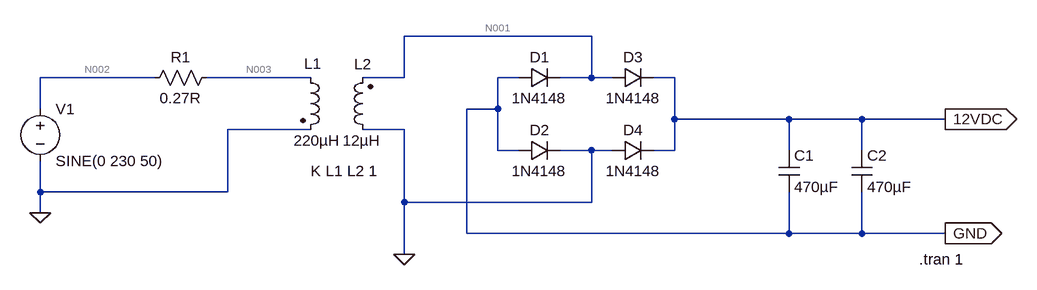
[diagram p0: schematic AC-DC CONVERTER.asc]
AC-DC CONVERTER.asc, the LTspice schematic file:
Version 4
SHEET 1 1160 680
WIRE 480 -16 192 -16
WIRE -192 48 -368 48
WIRE 48 48 -112 48
WIRE 192 48 192 -16
WIRE 192 48 128 48
WIRE 368 48 336 48
WIRE 480 48 480 -16
WIRE 480 48 432 48
WIRE 512 48 480 48
WIRE 608 48 576 48
WIRE -368 96 -368 48
WIRE 336 96 336 48
WIRE 336 96 288 96
WIRE 608 112 608 48
WIRE 784 112 608 112
WIRE 896 112 784 112
WIRE 1024 112 896 112
WIRE 48 128 -80 128
WIRE 192 128 128 128
WIRE 336 160 336 96
WIRE 368 160 336 160
WIRE 480 160 432 160
WIRE 512 160 480 160
WIRE 608 160 608 112
WIRE 608 160 576 160
WIRE 784 160 784 112
WIRE 896 160 896 112
WIRE -368 224 -368 176
WIRE -80 224 -80 128
WIRE -80 224 -368 224
WIRE 192 240 192 128
WIRE 480 240 480 160
WIRE 480 240 192 240
WIRE -368 256 -368 224
WIRE 288 288 288 96
WIRE 784 288 784 224
WIRE 784 288 288 288
WIRE 896 288 896 224
WIRE 896 288 784 288
WIRE 1024 288 896 288
WIRE 192 320 192 240
FLAG -368 256 0
FLAG 192 320 0
FLAG 1024 112 12VDC
IOPIN 1024 112 Out
FLAG 1024 288 GND
IOPIN 1024 288 Out
SYMBOL voltage -368 80 R0
WINDOW 123 0 0 Left 0
WINDOW 39 0 0 Left 0
SYMATTR InstName V1
SYMATTR Value SINE(0 230 50)
SYMBOL res -96 32 R90
WINDOW 0 0 56 VBottom 2
WINDOW 3 32 56 VTop 2
SYMATTR InstName R1
SYMATTR Value 0.27R
SYMBOL ind2 32 32 R0
WINDOW 0 6 -6 Left 2
WINDOW 3 -10 113 Left 2
SYMATTR InstName L1
SYMATTR Value 220µH
SYMATTR Type ind
SYMBOL ind2 144 144 R180
WINDOW 0 2 117 Left 2
WINDOW 3 -11 -1 Left 2
SYMATTR InstName L2
SYMATTR Value 12µH
SYMATTR Type ind
SYMBOL diode 368 64 R270
WINDOW 0 32 32 VTop 2
WINDOW 3 0 32 VBottom 2
SYMATTR InstName D1
SYMATTR Value 1N4148
SYMBOL diode 368 176 R270
WINDOW 0 32 32 VTop 2
WINDOW 3 0 32 VBottom 2
SYMATTR InstName D2
SYMATTR Value 1N4148
SYMBOL diode 512 64 R270
WINDOW 0 32 32 VTop 2
WINDOW 3 0 32 VBottom 2
SYMATTR InstName D3
SYMATTR Value 1N4148
SYMBOL diode 512 176 R270
WINDOW 0 32 32 VTop 2
WINDOW 3 0 32 VBottom 2
SYMATTR InstName D4
SYMATTR Value 1N4148
SYMBOL cap 768 160 R0
SYMATTR InstName C1
SYMATTR Value 470µF
SYMBOL cap 880 160 R0
SYMATTR InstName C2
SYMATTR Value 470µF
TEXT 48 192 Left 2 !K L1 L2 1
TEXT 984 328 Left 2 !.tran 1

The netlist it stands for:
* AC-DC CONVERTER.asc
V1 N002 0 SINE(0 230 50)
R1 N003 N002 0.27R
L1 N003 0 220µH
L2 0 N001 12µH
D1 GND N001 1N4148
D2 GND 0 1N4148
D3 N001 12VDC 1N4148
D4 0 12VDC 1N4148
C1 12VDC GND 470µF
C2 12VDC GND 470µF
.model D D
.lib standard.dio
K L1 L2 1
.tran 1
.backanno
.end

* Results of the author's LTspice run, read from the files saved beside the schematic
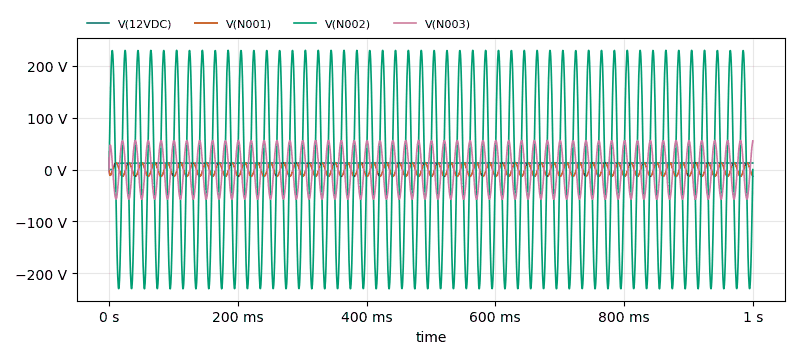
[diagram p1: Transient Analysis of AC-DC CONVERTER.asc, plotted from the saved traces]
* Transient Analysis, 1 run:
*   V(12VDC): min 0 V, max 12.74 V, average 12.57 V, rms 12.62 V, last 12.74 V
*   V(N001): min -13.12 V, max 13.37 V, average 37.41 mV, rms 9.305 V, last -12.92 V
*   V(N002): min -230 V, max 230 V, average -146 mV, rms 162.9 V, last 0 V
*   V(N003): min -57.26 V, max 56.18 V, average -160.2 mV, rms 39.84 V, last 55.31 V